# EAGLE schematic solar_tester (EAGLE 9.2.1)
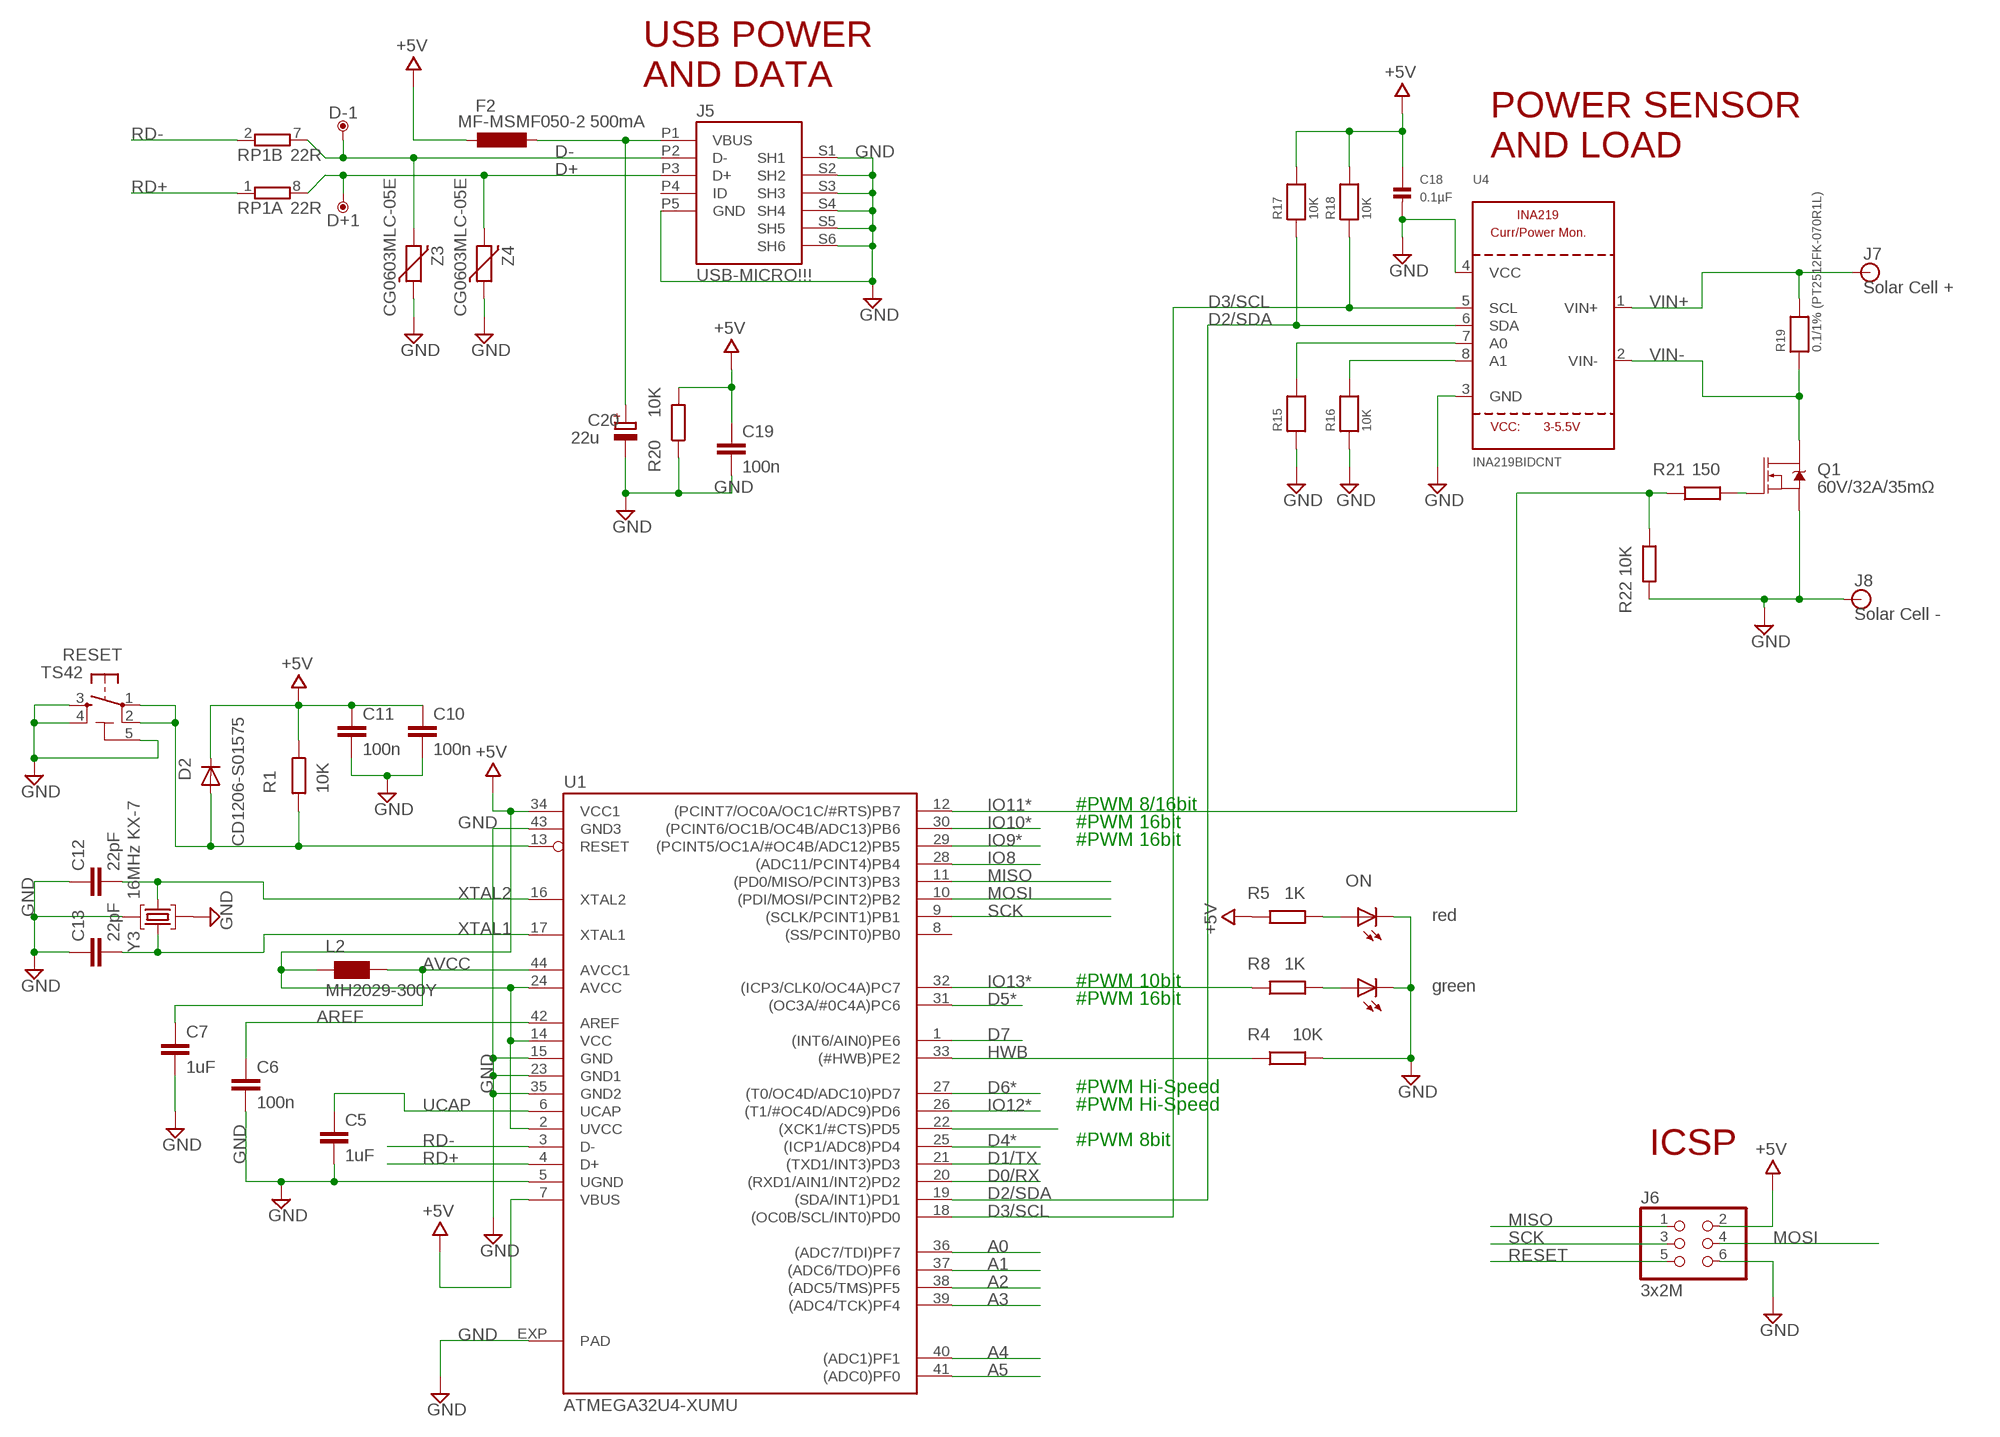
[diagram p0: schematic, sheet 1]

## Parts
C5  1uF  C-EUC0402  [C0402]
C6  100n  C-EUC0402  [C0402]
C7  1uF  C-EUC0402  [C0402]
C10  100n  C-EUC0402  [C0402]
C11  100n  C-EUC0402  [C0402]
C12  22pF  C-EUC0402  [C0402]
C13  22pF  C-EUC0402  [C0402]
C18  0.1µF  CAP_CERAMIC0805  [0805]
C19  100n  C-EUC0402  [C0402]
C20  22u  CPOL-EUSMCB  [SMC_B]
D2  CD1206-S01575  DIODE-MINIMELF  [MINIMELF]
D+1  DNP  TPTP-1.00MM  [TP-1.00MM]
D-1  DNP  TPTP-1.00MM  [TP-1.00MM]
F2  MF-MSMF050-2 500mA  L-EUL1812  [L1812]
J5  USB-MICRO!!!  MYCON2_USB-MINI-B  [CON2_USB_MICRO_B_AT]
J6  3x2M  PINHD-2X3  [2X03]
J7  Solar Cell +  BANANA_CONN  [BANANA_CONN]
J8  Solar Cell -  BANANA_CONN  [BANANA_CONN]
L  green  LEDCHIPLED_0805  [CHIPLED_0805]
L2  MH2029-300Y  WE-CBF_0805  [0805]
ON  red  LEDCHIPLED_0805  [CHIPLED_0805]
Q1  60V/32A/35mΩ  MOSFET-NCH-FQP30N06L  [TO220V]
R1  10K  R-EU_R0402  [R0402]
R4  10K  R-EU_R0402  [R0402]
R5  1K  R-EU_R0402  [R0402]
R8  1K  R-EU_R0402  [R0402]
R15  10K  RESISTOR0805  [0805]
R16  10K  RESISTOR0805  [0805]
R17  10K  RESISTOR0805  [0805]
R18  10K  RESISTOR0805  [0805]
R19  0.1/1% (PT2512FK-070R1L)  RESISTOR2512  [2512]
R20  10K  R-EU_R0402  [R0402]
R21  150  R-EU_R0402  [R0402]
R22  10K  R-EU_R0402  [R0402]
RESET  TS42  [TS42]
RP1  22R  4R-NCAY16  [CAY16]
U1  ATMEGA32U4-XUMU  [QFN44ML7X7]
U4  INA219BIDCNT  INA219  [SOT23-8]
Y3  16MHz KX-7  CRYSTAL-3.2-2.5  [CRYSTAL-3.2-2.5]
Z3  CG0603MLC-05E  VARISTORCN0603  [CT/CN0603]
Z4  CG0603MLC-05E  VARISTORCN0603  [CT/CN0603]

## Nets
+5V: C10.1 C11.1 C18.1 C19.1 D2.C F2.2 J6.2 L2.1 R1.1 R5.1 R17.2 R18.2 R20.2 U1.2(UVCC) U1.7(VBUS) U1.14(VCC) U1.24(AVCC) U1.34(VCC1)
A0: U1.36((ADC7/TDI)PF7)
A1: U1.37((ADC6/TDO)PF6)
A2: U1.38((ADC5/TMS)PF5)
A3: U1.39((ADC4/TCK)PF4)
A4: U1.40((ADC1)PF1)
A5: U1.41((ADC0)PF0)
AREF: C6.1 U1.42(AREF)
AVCC: C7.1 L2.2 U1.44(AVCC1)
D0/RX: U1.20((RXD1/AIN1/INT2)PD2)
D1/TX: U1.21((TXD1/INT3)PD3)
D2/SDA: R17.1 U1.19((SDA/INT1)PD1) U4.6(SDA)
D3/SCL: R18.1 U1.18((OC0B/SCL/INT0)PD0) U4.5(SCL)
D4*: U1.25((ICP1/ADC8)PD4)
D5*: U1.31((OC3A/#0C4A)PC6)
D6*: U1.27((T0/OC4D/ADC10)PD7)
D7: U1.1((INT6/AIN0)PE6)
D+: D+1.X J5.P3(D+) RP1.8 Z4.2
D-: D-1.X J5.P2(D-) RP1.7 Z3.2
GND: C5.2 C6.2 C7.2 C10.2 C11.2 C12.1 C13.1 C18.2 C19.2 C20.- J5.P5(GND) J5.S1(SH1) J5.S2(SH2) J5.S3(SH3) J5.S4(SH4) J5.S5(SH5) J5.S6(SH6) J6.6 J8.P$1 L.C ON.C Q1.3(S) R4.2 R15.1 R16.1 R20.1 R22.1 RESET.3 RESET.4 RESET.5(5-GND) U1.5(UGND) U1.15(GND) U1.23(GND1) U1.35(GND2) U1.43(GND3) U1.EXP(PAD) U4.3(GND) U4.4(VCC) Y3.2(GND) Y3.4(GND) Z3.1 Z4.1
HWB: R4.1 U1.33((#HWB)PE2)
IO8: U1.28((ADC11/PCINT4)PB4)
IO9*: U1.29((PCINT5/OC1A/#OC4B/ADC12)PB5)
IO10*: U1.30((PCINT6/OC1B/OC4B/ADC13)PB6)
IO11*: R21.1 R22.2 U1.12((PCINT7/OC0A/OC1C/#RTS)PB7)
IO12*: U1.26((T1/#OC4D/ADC9)PD6)
IO13*: R8.1 U1.32((ICP3/CLK0/OC4A)PC7)
MISO: J6.1 U1.11((PD0/MISO/PCINT3)PB3)
MOSI: J6.4 U1.10((PDI/MOSI/PCINT2)PB2)
N$3: ON.A R5.2
N$7: L.A R8.2
N$8: R16.2 U4.8(A1)
N$9: D2.A R1.2 RESET.1 RESET.2 U1.13(RESET)
N$11: R15.2 U4.7(A0)
N$13: Q1.1(G) R21.2
RD+: RP1.1 U1.4(D+)
RD-: RP1.2 U1.3(D-)
RESET: J6.5
SCK: J6.3 U1.9((SCLK/PCINT1)PB1)
TXLED: U1.22((XCK1/#CTS)PD5)
UCAP: C5.1 U1.6(UCAP)
VBUS: C20.+ F2.1 J5.P1(VBUS)
VIN+: J7.P$1 R19.2 U4.1(VIN+)
VIN-: Q1.2(D) R19.1 U4.2(VIN-)
XTAL1: C13.2 U1.17(XTAL1) Y3.3(C2)
XTAL2: C12.2 U1.16(XTAL2) Y3.1(C1)
Unconnected: J5.P4(ID) RP1.3 RP1.4 RP1.5 RP1.6 U1.8((SS/PCINT0)PB0)

## Notes on the sheet
- USB POWER
  AND DATA
- POWER SENSOR
  AND LOAD
- #PWM 8/16bit
- #PWM 16bit
- #PWM 16bit
- #PWM 10bit
- #PWM 16bit
- #PWM Hi-Speed
- #PWM Hi-Speed
- #PWM 8bit
- ICSP

## Library data of the parts
C5-C7 C10-C13 C19 = gen_comp:C-EU: CAPACITOR, European symbol
C18 = microbuilder:CAP_CERAMIC: Ceramic Capacitors 0402 - 0402 Surface Mount Capacitors 16pF 50V 5% [Digikey: 445-4899-2-ND] 18pF 50V 5% [Digikey: 490-1281-2-ND] 22pF 50V 5% [Digikey: 490-1283-2-ND] 68pF 50V 5% [Digikey: 490-1289-2-ND] 0.1uF 10V 10% [Digikey: 490-1318-2-ND] 1.0uF 6.3V 10% [Digikey: 490-1320-2-ND] 0603 - 0603 Surface Mount Capacitors 16 pF 50V 5% [Digikey: 445-5051-2-ND] 22 pF 50V [Digikey: PCC220ACVTR-ND] 33 pF 50V 5% [Digikey: 490-1415-1-ND] 56pF 50V 5% [Digikey: 490-1421-1-ND] 220pF 50V 5% [Digikey: 445-1285-1-ND] 680 pF 50V 2200 pF 50V 5% C0G [Digikey: 445-1297-1-ND] 5600 pF 100V 5% X7R [Digikey: 478-3711-1-ND] 0.1 µF 25V 10% [Digikey: PCC2277TR-ND] 0.22 µF 16V 10% X7R [Digikey: 445-1318-1-ND] 1.0 µF 25V 10% [Digikey: 445-5146-2-ND] 0603 - RF Specific 3pF 250V +/-0.1pF RF [Digikey: 712-1347-1-ND] 18 pF 250V 5% [Digikey: 478-3505-1-ND or 712-1322-1-ND] 56 pF 250V 5% C0G RF [Digikey: 490-4867-1-ND] 68 pF 250V RF [Digikey: 490-4868-1-ND] 0805 - 0805 Surface Mount Capacitors 220 pF 250V 2% RF Ceramic Capacitor [Digikey: 712-1398-1-ND] 1000 pF 50V 2% NP0 Ceramic Capacitor [Digikey: 478-3760-1-ND] 0.1 µF 25V 10% Ceramic Capacitor [Digikey: PCC1828TR-ND] 1.0 µF 16V 10% Ceramic Capacitor[Digikey: 490-1691-2-ND] 10.0 µF 10V 10% Ceramic Capacitor[Digikey: 709-1228-1-ND] 10.0 uF 16V 10% Ceramic Capacitor [Digikey: 478-5165-2-ND] 47 uF 6.3V 20% Ceramic Capacitor [Digikey: 587-1779-1-ND or 399-5506-1-ND] 1206 - 1206 Surface Mount Capacitors 47uF 10V 20% Ceramic Capacitor [Digikey: 490-5528-1-ND or 399-5508-1-ND or 445-6010-1-ND] 100uF 6.3V -20%, +80% Y5V Ceramic Capacitor (Digikey: 490-4512-1-ND, Mouser: 81-GRM31CF50J107ZE1L)
C20 = rcl:CPOL-EU: POLARIZED CAPACITOR, European symbol
D2 = diode:DIODE-: DIODE
D+1 D-1 = Arduino-utility:TP: Testpoint; DATASHEET: DNP; DISTRIBUTOR-LINK: DNP; DISTRIBUTOR-PN: DNP; MANUFACTURER: DNP; MANUFACTURER-PN: DNP
F2 = rcl:L-EU: INDUCTOR, European symbol
J5 = gen_comp:MYCON2_USB-MINI-B
J6 = gen_comp:PINHD-2X3: PIN HEADER
J7 J8 = SparkFun-Connectors:BANANA_CONN: Through-hole Banana Jack Basic PTH connection for banana jack plugs SparkFun Products: Multimeter Kit <https://www.sparkfun.com/products/retired/10956> Banana to Alligator Cable <https://www.sparkfun.com/products/retired/509> Banana to Alligator Coax Cable <https://www.sparkfun.com/products/retired/508> Banana to Banana Cable <https://www.sparkfun.com/products/retired/507> Banana to IC Hook Cables <https://www.sparkfun.com/products/retired/506>
L ON = led:LED: LED OSRAM: - CHIPLED LG R971, LG N971, LY N971, LG Q971, LY Q971, LO R971, LY R971 LH N974, LH R974 LS Q976, LO Q976, LY Q976 LO Q996 - Hyper CHIPLED LW Q18S LB Q993, LB Q99A, LB R99A - SideLED LS A670, LO A670, LY A670, LG A670, LP A670 LB A673, LV A673, LT A673, LW A673 LH A674 LY A675 LS A676, LA A676, LO A676, LY A676, LW A676 LS A679, LY A679, LG A679 - Hyper Micro SIDELED® LS Y876, LA Y876, LO Y876, LY Y876 LT Y87S - SmartLED LW L88C, LW L88S LB L89C, LB L89S, LG L890 LS L89K, LO L89K, LY L89K LS L896, LA L896, LO L896, LY L896 - TOPLED LS T670, LO T670, LY T670, LG T670, LP T670 LSG T670, LSP T670, LSY T670, LOP T670, LYG T670 LG T671, LOG T671, LSG T671 LB T673, LV T673, LT T673, LW T673 LH T674 LS T676, LA T676, LO T676, LY T676, LB T676, LH T676, LSB T676, LW T676 LB T67C, LV T67C, LT T67C, LS T67K, LO T67K, LY T67K, LW E67C LS E67B, LA E67B, LO E67B, LY E67B, LB E67C, LV E67C, LT E67C LW T67C LS T679, LY T679, LG T679 LS T770, LO T770, LY T770, LG T770, LP T770 LB T773, LV T773, LT T773, LW T773 LH T774 LS E675, LA E675, LY E675, LS T675 LS T776, LA T776, LO T776, LY T776, LB T776 LHGB T686 LT T68C, LB T68C - Hyper Mini TOPLED® LB M676 - Mini TOPLED Santana® LG M470 LS M47K, LO M47K, LY M47K Source: http://www.osram.convergy.de LUXEON: - LUMILED® LXK2-PW12-R00, LXK2-PW12-S00, LXK2-PW14-U00, LXK2-PW14-V00 LXK2-PM12-R00, LXK2-PM12-S00, LXK2-PM14-U00 LXK2-PE12-Q00, LXK2-PE12-R00, LXK2-PE12-S00, LXK2-PE14-T00, LXK2-PE14-U00 LXK2-PB12-K00, LXK2-PB12-L00, LXK2-PB12-M00, LXK2-PB14-N00, LXK2-PB14-P00, LXK2-PB14-Q00 LXK2-PR12-L00, LXK2-PR12-M00, LXK2-PR14-Q00, LXK2-PR14-R00 LXK2-PD12-Q00, LXK2-PD12-R00, LXK2-PD12-S00 LXK2-PH12-R00, LXK2-PH12-S00 LXK2-PL12-P00, LXK2-PL12-Q00, LXK2-PL12-R00 Source: www.luxeon.com KINGBRIGHT: KA-3528ASYC Source: www.kingbright.com
L2 = wuerth-elektronik:WE-CBF: SMD EMI Suppression Ferrite Beads - excellent anti-EMI properties - low DCR - impedances till 3000 ohms - rated current up to 6 A
Q1 = SparkFun-DiscreteSemi:MOSFET-NCH: N-channel MOSFETs Voltage controlled devices that allow control of high current outputs. SparkFun Products: SparkFun OpenScale <https://www.sparkfun.com/products/13261> SparkFun Digital Sandbox <https://www.sparkfun.com/products/12651> SparkFun Monster Moto Shield <https://www.sparkfun.com/products/10182> SparkFun MOSFET Power Controller <https://www.sparkfun.com/products/11214>; PROD_ID: TRANS-10060
R1 R4 R5 R8 R20-R22 = gen_comp:R-EU_: RESISTOR, European symbol
R15-R19 = microbuilder:RESISTOR: Resistors 0402 - 0402 Surface Mount Package 22 Ohm 1% 1/16W [Digikey: 311-22.0LRTR-ND] 33 Ohm 5% 1/16W 1.0K 5% 1/16W 1.5K 5% 1/16W 2.0K 1% 1/16W 10.0K 1% 1/16W [Digikey: 311-10.0KLRTR-ND] 10.0K 5% 1/16W [Digikey: RMCF0402JT10K0TR-ND] 12.1K 1% 1/16W [Digikey: 311-22.0LRTR-ND] 100.0K 5% 1/16W 0603 - 0603 Surface Mount Package 0 Ohm 1/10 Watt 1% Resistor 15 Ohm 1/10 Watt 1% Resistor 33 Ohm 1/10 Watt 1% Resistor 49.9 Ohm 1/10 Watt 1% Resistor 100 Ohm 1/10 Watt 1% Resistor 150 Ohm 1/10 Watt 1% Resistor 240 Ohm 1/10 Watt 1% Resistor 390 Ohm 1/10 Watt 1% Resistor 560 Ohm 1/10 Watt 1% Resistor 680 Ohm 1/10 Watt 1% Resistor 750 Ohm 1/10 Watt 1% Resistor 1.0K Ohm 1/10 Watt 1% Resistor 1.5K Ohm 1/10 Watt 1% Resistor 2.0K Ohm 1/10 Watt 1% Resistor 2.2K Ohm 1/10 Watt 1% Resistor 3.3K Ohm 1/10 Watt 1% Resistor 4.7K Ohm 1/10 Watt 1% Resistor 10.0K Ohm 1/10 Watt 1% Resistor 12.0K Ohm 1/10 Watt 1% Resistor 12.1K Ohm 1/10 Watt 1% Resistor 20.0K Ohm 1/10 Watt 1% Resistor 33.0K Ohm 1/10 Watt 1% Resistor 100.0K Ohm 1/10 Watt 1% Resistor 0805 - 0805 Surface Mount Package 0 Ohm 1/8 Watt 1% Resistor 33 Ohm 1/8 Watt 1% Resistor 100 Ohm 1/8 Watt 1% Resistor 150 Ohm 1/8 Watt 1% Resistor 200 Ohm 1/8 Watt 1% Resistor 240 Ohm 1/8 Watt 1% Resistor 330 Ohm 1/8 Watt 1% Resistor 390 Ohm 1/8 Watt 1% Resistor 470 Ohm 1/8 Watt 1% Resistor 1.0K Ohm 1/8 Watt 1% Resistor 1.5K Ohm 1/8 Watt 1% Resistor 2.0K Ohm 1/8 Watt 1% Resistor 4.7K Ohm 1/8 Watt 1% Resistor 5.1K Ohm 1/8 Watt 1% Resistor 5.6K Ohm 1/8 Watt 1% Resistor 10.0K Ohm 1/8 Watt 1% Resistor 22.0K Ohm 1/8 Watt 1% Resistor 33.0K Ohm 1/8 Watt 1% Resistor 100K Ohm 1/8 Watt 1% Resistor 1206 - 1206 Surface Mount Package 2012 - 2010 Surface Mount Package 0.11 Ohm 1/2 Watt 1% Resistor - Digikey: RHM.11UCT-ND
RESET = Arduino:TS42: TS42 Dongnan Electronics Tact switch VDC 12V - 50mA
RP1 = resistor-dil:4R-N: Array Chip Resistor Source: RS Component / Phycomp
U1 = gen_comp:ATMEGA32U4-XU
U4 = microbuilder:INA219: INA219 - I2C Current/Power Monitor Voltage Range: 0-26V Accuracy: 0.5% Temperature: -40°C - 125°C
Y3 = gen_comp:CRYSTAL-3.2-2.5
Z3 Z4 = varistor:VARISTOR: VARISTOR

## Net classes
0 default: width 0.254 mm, drill 0.5 mm, clearance 0.203 mm